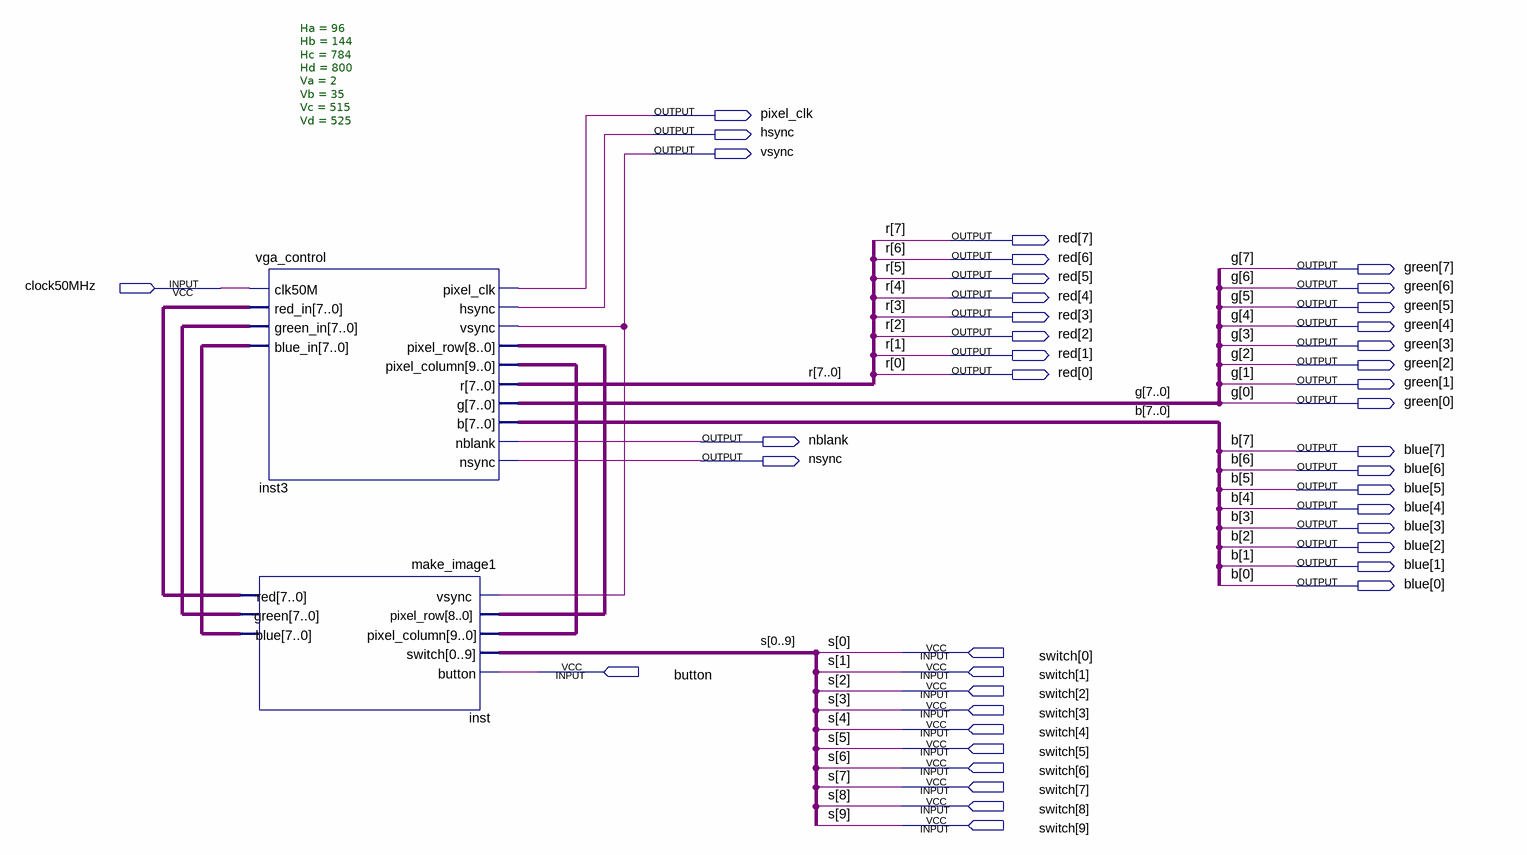
[diagram p0: schematic sheet]
// Quartus schematic VGA.bdf as structural Verilog: 2 symbols, 41 pins
module VGA (
  input  clock50MHz,
  input  [9:0] switch,
  input  button,
  output pixel_clk,
  output hsync,
  output vsync,
  output [7:0] red,
  output [7:0] green,
  output nblank,
  output [7:0] blue,
  output nsync
);

  wire [7:0] inst_blue, inst_green, inst_red;
  wire [8:0] inst3_pixel_row;
  wire [9:0] inst3_pixel_column;

  vga_control #(.Ha(96), .Hb(144), .Hc(784), .Hd(800), .Va(2), .Vb(35), .Vc(515), .Vd(525)) inst3 (
    .clk50M(clock50MHz), .red_in(inst_red), .green_in(inst_green), .blue_in(inst_blue),
    .pixel_clk(pixel_clk), .hsync(hsync), .vsync(vsync), .pixel_row(inst3_pixel_row),
    .pixel_column(inst3_pixel_column), .r(red), .g(green), .b(blue), .nblank(nblank), .nsync(nsync));
  make_image1 inst (
    .vsync(vsync), .pixel_row(inst3_pixel_row), .pixel_column(inst3_pixel_column),
    .switch({switch[0], switch[1], switch[2], switch[3], switch[4], switch[5], switch[6], switch[7], switch[8], switch[9]}),
    .button(button), .red(inst_red), .green(inst_green), .blue(inst_blue));

  // Other names for the same wires on the sheet: b[7:0] = blue; g[7:0] = green; r[7:0] = red; s[9:0] = switch
endmodule
